# Altium project C-metr.PrjPcb (part 2 of 2)
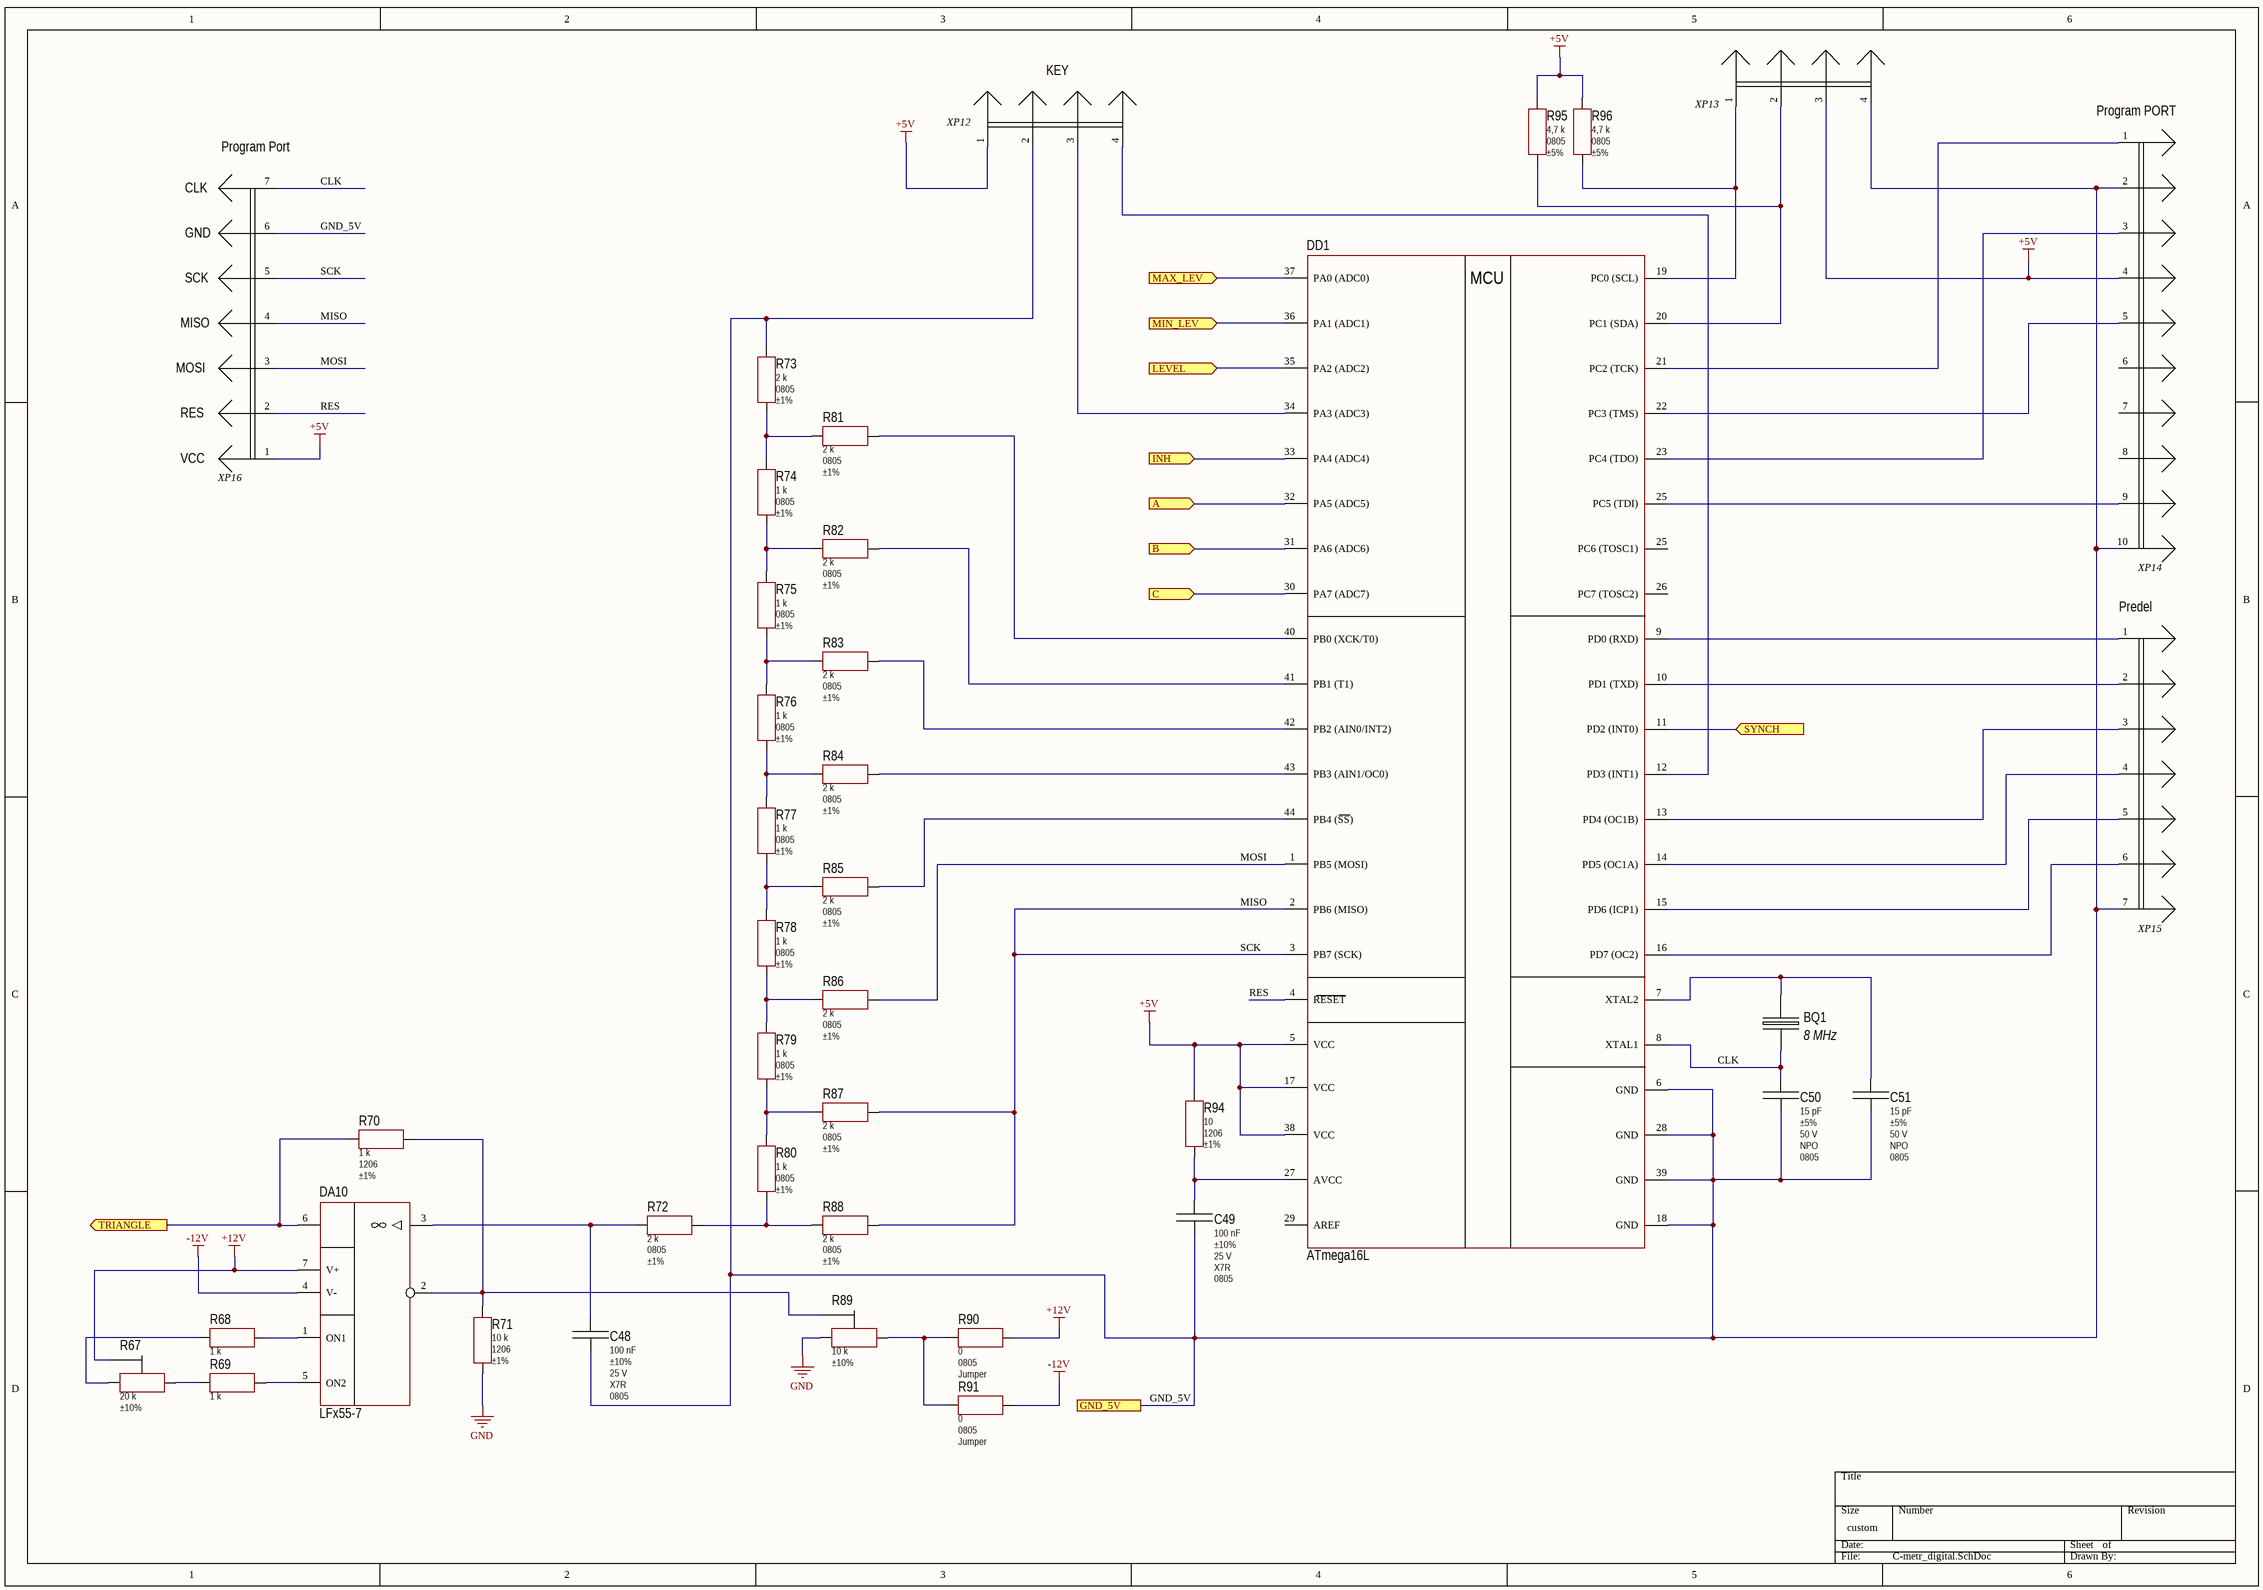
[diagram p7: C-metr_digital.SchDoc]

## Nets that join several sheets
+5V: C-metr_analog (C27.2 C30.2 C33.2 DA7.2), C-metr_digital (10 pins)
+12V: C-metr_analog (21 pins), C-metr_digital (DA10.7 R67.2 R90.1)
-12V: C-metr_analog (17 pins), C-metr_digital (DA10.4 R91.1)
GND: C-metr_analog (57 pins), C-metr_digital (R71.1 R89.3)
A: C-metr_analog (DA2.11), C-metr_digital (DD1.32)
B: C-metr_analog (DA2.10), C-metr_digital (DD1.31)
C: C-metr_analog (DA2.9), C-metr_digital (DD1.30)
GND_5V: C-metr_analog (6 pins), C-metr_digital (15 pins)
INH: C-metr_analog (DA2.6), C-metr_digital (DD1.33)
NetC40_1: C-metr_analog (7 pins), C-metr_digital (DD1.36)
NetDA10_6: C-metr_analog (R3.1), C-metr_digital (DA10.6 R70.1)
NetDD1_11: C-metr_analog (R24.1 R25.2), C-metr_digital (DD1.11)
NetDD1_35: C-metr_analog (R40.2 R41.1), C-metr_digital (DD1.35)
NetDD1_37: C-metr_analog (R50.1 R52.2), C-metr_digital (DD1.37)